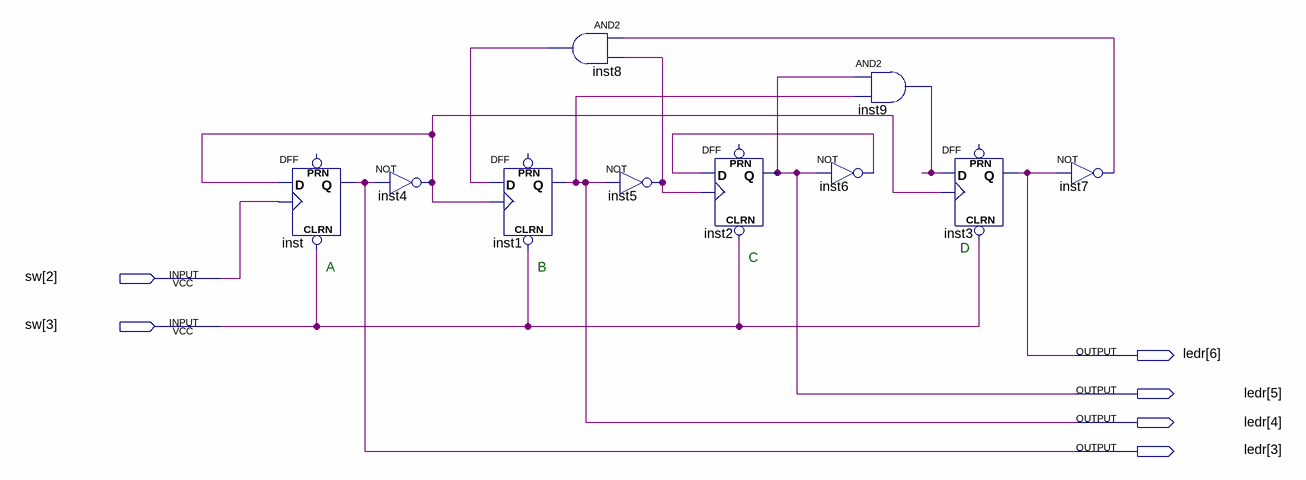
[diagram p0: schematic sheet]
// Quartus schematic mod10.bdf as structural Verilog: 10 symbols, 6 pins
module mod10 (
  input  [3:2] sw,
  output [6:3] ledr
);

  wire inst4_out, inst5_out, inst6_out, inst7_out, inst8_out, inst9_out;

  DFF inst (.CLRN(sw[3]), .CLK(sw[2]), .D(inst4_out), .Q(ledr[3]));  // open: PRN
  not inst4 (inst4_out, ledr[3]);
  DFF inst1 (.CLRN(sw[3]), .CLK(inst4_out), .D(inst8_out), .Q(ledr[4]));  // open: PRN
  and inst8 (inst8_out, inst7_out, inst5_out);
  not inst5 (inst5_out, ledr[4]);
  DFF inst2 (.CLRN(sw[3]), .CLK(inst5_out), .D(inst6_out), .Q(ledr[5]));  // open: PRN
  and inst9 (inst9_out, ledr[5], ledr[4]);
  not inst6 (inst6_out, ledr[5]);
  DFF inst3 (.CLRN(sw[3]), .CLK(inst4_out), .D(inst9_out), .Q(ledr[6]));  // open: PRN
  not inst7 (inst7_out, ledr[6]);

  // Notes on the sheet:
  //   D
  //   C
  //   A
  //   B
endmodule
